# EAGLE design etherbotix (EAGLE 7.1.0)
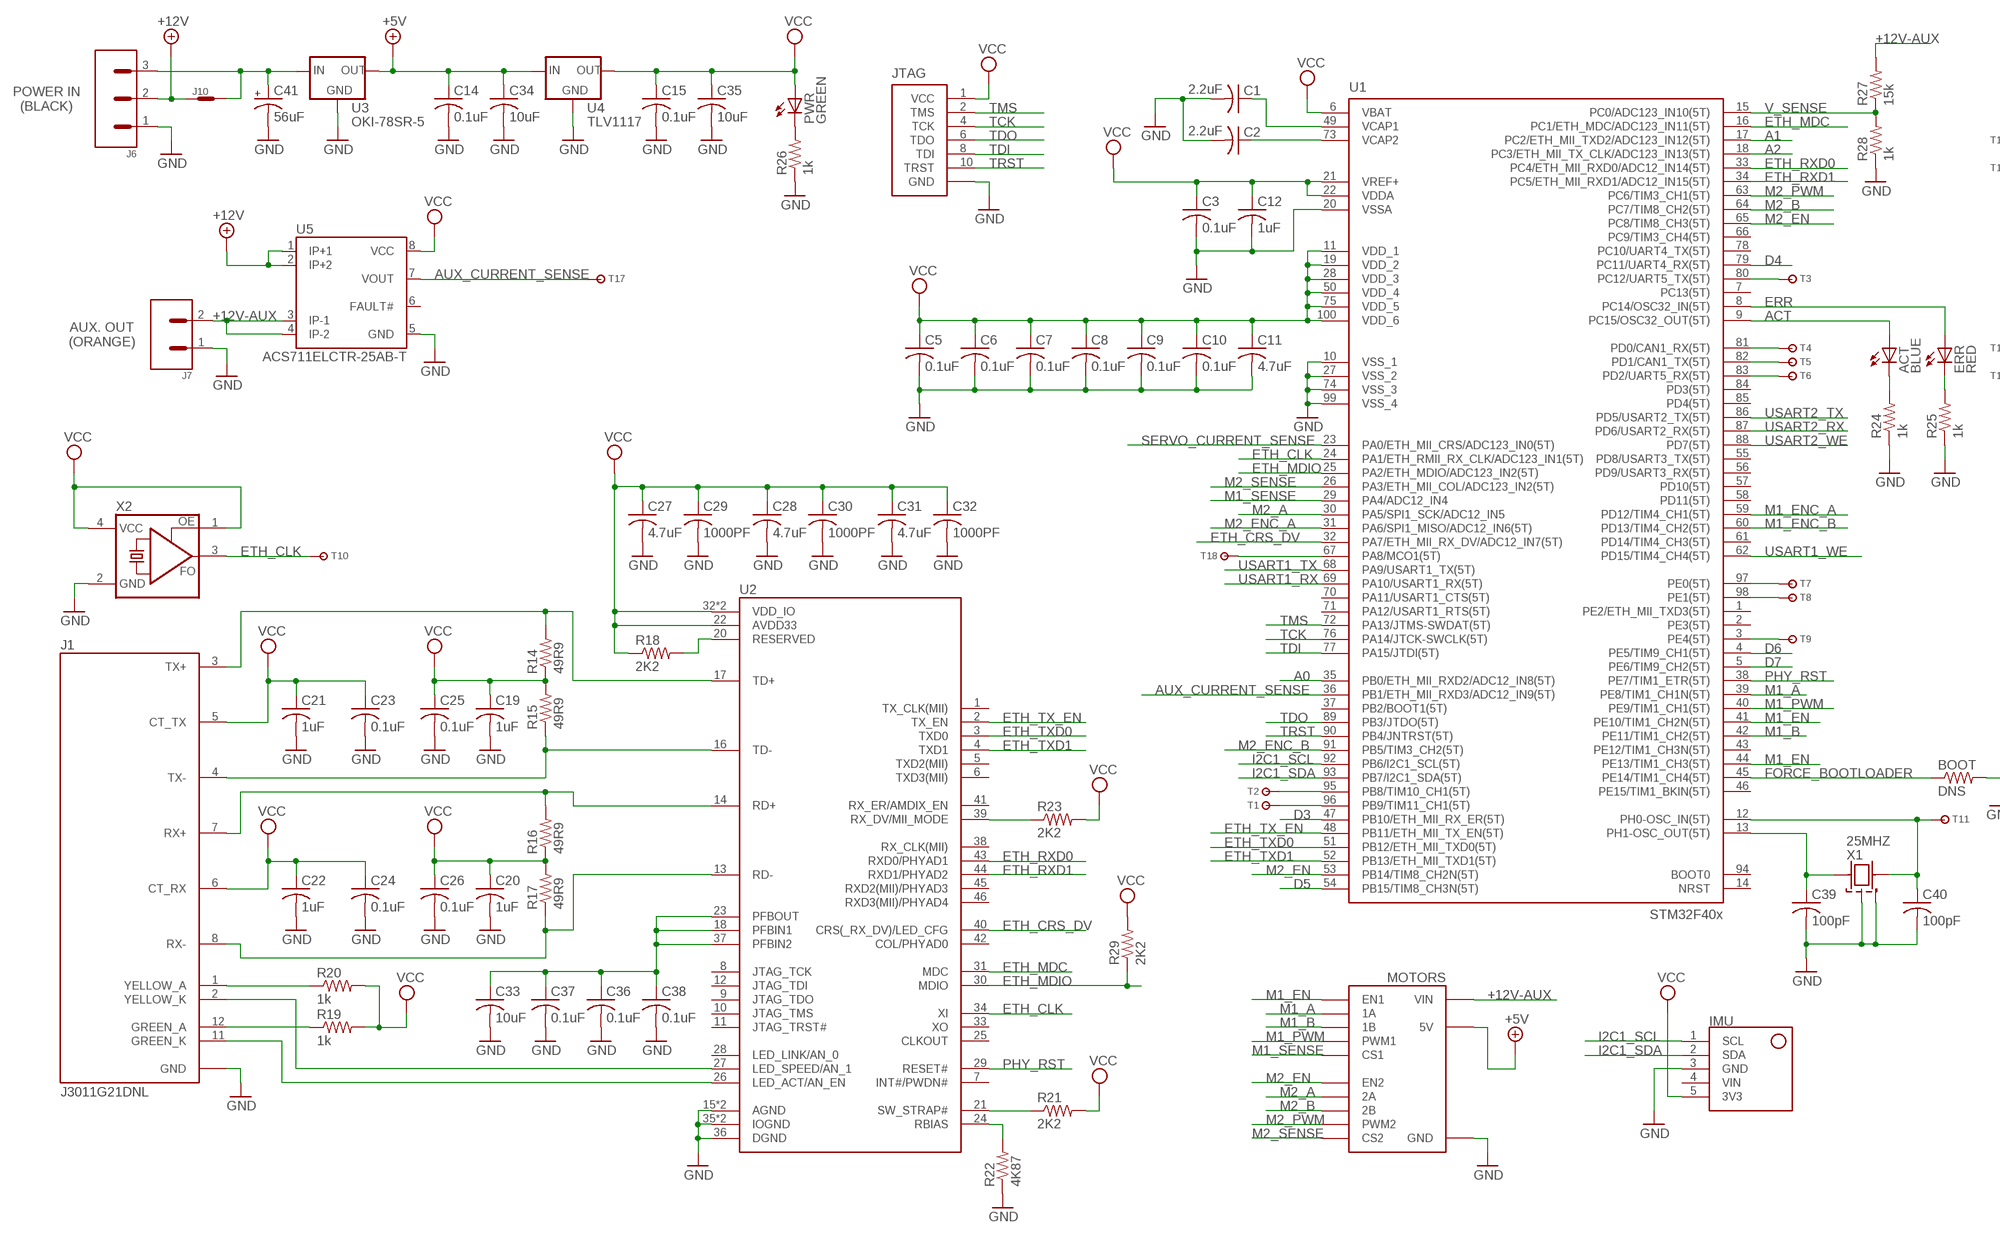
[diagram p0: schematic, sheet 1, part 1 of 2]
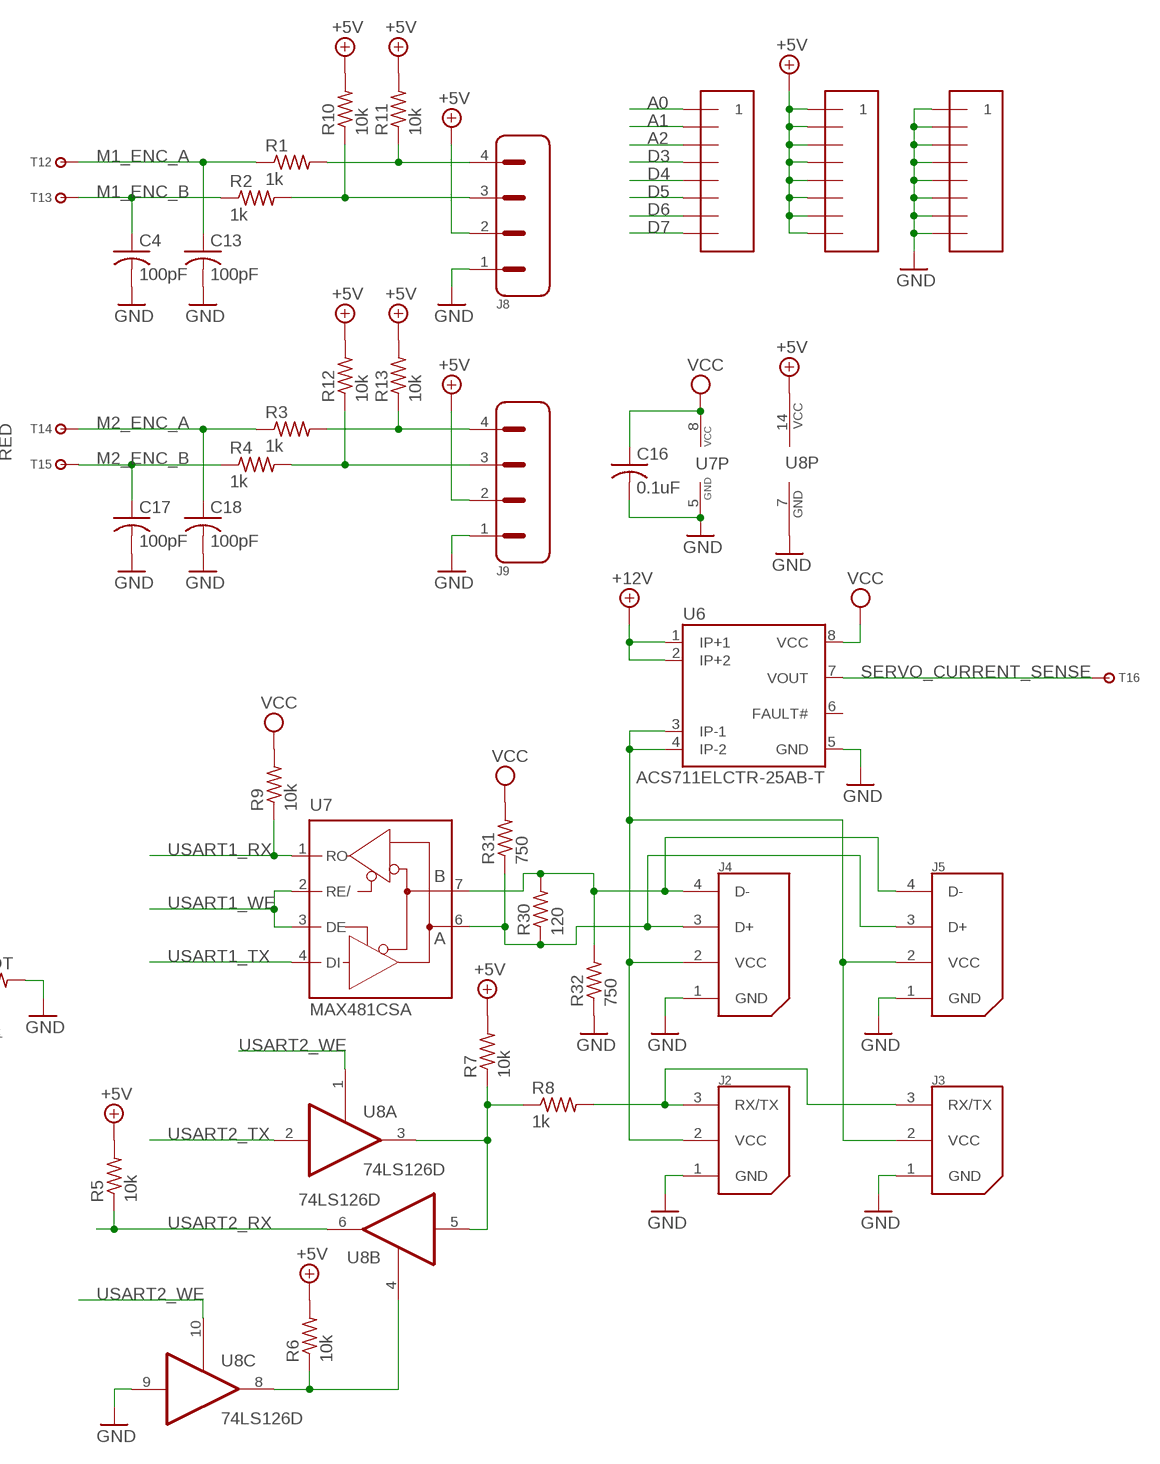
[diagram p1: schematic, sheet 1, part 2 of 2]

## Parts
ACT  BLUE  APT1608SGC  [LED0603]
BOOT  DNS  P1.00KHCT-ND  [0603]
C1  2.2uF  C1608X5R1C225K  [C0603]
C2  2.2uF  C1608X5R1C225K  [C0603]
C3  0.1uF  C1608X7R1H104K  [C0603]
C4  100pF  C1608C0G1H101J  [C0603]
C5  0.1uF  C1608X7R1H104K  [C0603]
C6  0.1uF  C1608X7R1H104K  [C0603]
C7  0.1uF  C1608X7R1H104K  [C0603]
C8  0.1uF  C1608X7R1H104K  [C0603]
C9  0.1uF  C1608X7R1H104K  [C0603]
C10  0.1uF  C1608X7R1H104K  [C0603]
C11  4.7uF  C1608X5R0J475K  [0603]
C12  1uF  C1608X5R1H105M  [C0603]
C13  100pF  C1608C0G1H101J  [C0603]
C14  0.1uF  C1608X7R1H104K  [C0603]
C15  0.1uF  C1608X7R1H104K  [C0603]
C16  0.1uF  C1608X7R1H104K  [C0603]
C17  100pF  C1608C0G1H101J  [C0603]
C18  100pF  C1608C0G1H101J  [C0603]
C19  1uF  C1608X5R1H105M  [C0603]
C20  1uF  C1608X5R1H105M  [C0603]
C21  1uF  C1608X5R1H105M  [C0603]
C22  1uF  C1608X5R1H105M  [C0603]
C23  0.1uF  C1608X7R1H104K  [C0603]
C24  0.1uF  C1608X7R1H104K  [C0603]
C25  0.1uF  C1608X7R1H104K  [C0603]
C26  0.1uF  C1608X7R1H104K  [C0603]
C27  4.7uF  C1608X5R0J475K  [0603]
C28  4.7uF  C1608X5R0J475K  [0603]
C29  1000PF  C1608X7R1H102K  [0603]
C30  1000PF  C1608X7R1H102K  [0603]
C31  4.7uF  C1608X5R0J475K  [0603]
C32  1000PF  C1608X7R1H102K  [0603]
C33  10uF  C1608X5R0J106M  [C0603]
C34  10uF  C1608X5R0J106M  [C0603]
C35  10uF  C1608X5R0J106M  [C0603]
C36  0.1uF  C1608X7R1H104K  [C0603]
C37  0.1uF  C1608X7R1H104K  [C0603]
C38  0.1uF  C1608X7R1H104K  [C0603]
C39  100pF  C1608C0G1H101J  [C0603]
C40  100pF  C1608C0G1H101J  [C0603]
C41  56uF  25SVPF56M  [OSCON_SVPF_6.3MM]
ERR  RED  APT1608SGC  [LED0603]
IMU  MINI9IMU  [MINI9IMU]
J1  J3011G21DNL  [J3]
J2  22-03-5035  [5267-3]
J3  22-03-5035  [5267-3]
J4  22-03-5045  [5267-4]
J5  22-03-5045  [5267-4]
J6  1760520000  [1760520000]
J7  1760490000  [1760490000]
J8  502443-0470  [502443-0470]
J9  502443-0470  [502443-0470]
J10  JUMPER  [J2]
JTAG  CORTEX_DEBUG-SHROUDED  [3220-10-0300-00]
MOTORS  MD03A  [MD03A]
PWR  GREEN  APT1608SGC  [LED0603]
R1  1k  P1.00KHCT-ND  [0603]
R2  1k  P1.00KHCT-ND  [0603]
R3  1k  P1.00KHCT-ND  [0603]
R4  1k  P1.00KHCT-ND  [0603]
R5  10k  P10.0KHCT-ND  [0603]
R6  10k  P10.0KHCT-ND  [0603]
R7  10k  P10.0KHCT-ND  [0603]
R8  1k  P1.00KHCT-ND  [0603]
R9  10k  P10.0KHCT-ND  [0603]
R10  10k  P10.0KHCT-ND  [0603]
R11  10k  P10.0KHCT-ND  [0603]
R12  10k  P10.0KHCT-ND  [0603]
R13  10k  P10.0KHCT-ND  [0603]
R14  49R9  P49.9HCT-ND  [0603]
R15  49R9  P49.9HCT-ND  [0603]
R16  49R9  P49.9HCT-ND  [0603]
R17  49R9  P49.9HCT-ND  [0603]
R18  2K2  P2.20KHCT-ND  [0603]
R19  1k  P1.00KHCT-ND  [0603]
R20  1k  P1.00KHCT-ND  [0603]
R21  2K2  P2.20KHCT-ND  [0603]
R22  4K87  P4.87KHCT-ND  [0603]
R23  2K2  P2.20KHCT-ND  [0603]
R24  1k  P1.00KHCT-ND  [0603]
R25  1k  P1.00KHCT-ND  [0603]
R26  1k  P1.00KHCT-ND  [0603]
R27  15k  P15.0KHCT-ND  [0603]
R28  1k  P1.00KHCT-ND  [0603]
R29  2K2  P2.20KHCT-ND  [0603]
R30  120  P120HCT-ND  [0603]
R31  750  P750HCT-ND  [0603]
R32  750  P750HCT-ND  [0603]
T1  TESTPAD  [TEST]
T2  TESTPAD  [TEST]
T3  TESTPAD  [TEST]
T4  TESTPAD  [TEST]
T5  TESTPAD  [TEST]
T6  TESTPAD  [TEST]
T7  TESTPAD  [TEST]
T8  TESTPAD  [TEST]
T9  TESTPAD  [TEST]
T10  TESTPAD  [TEST]
T11  TESTPAD  [TEST]
T12  TESTPAD  [TEST]
T13  TESTPAD  [TEST]
T14  TESTPAD  [TEST]
T15  TESTPAD  [TEST]
T16  TESTPAD  [TEST]
T17  TESTPAD  [TEST]
T18  TESTPAD  [TEST]
U1  STM32F407V  [TQFP100]
U2  TLK110  [LQFP48]
U3  OKI-78SR-5  OKI-78SR-5/1.5-W36-C  [OKI-78SR]
U4  TLV1117  TLV1117-33IKVURG3KVU  [DPAK]
U5  ACS711ELCTR-25AB-T  [SOIC8]
U6  ACS711ELCTR-25AB-T  [SOIC8]
U7  MAX481CSA  [SO08]
U8  74LS126D  [SO14]
U$1  HEADER8  [1X8]
U$2  HEADER8  [1X8]
U$3  HEADER8  [1X8]
X1  25MHZ  ABM3B-25.000MHZ-B2-T  [4LCC]
X2  ASEMB-50.000MHZ-XY-T  [OSCILLATOR]

## Nets
+5V: C14.1 C34.1 J8.2 J9.2 MOTORS.5V R5.2 R6.2 R7.2 R10.2 R11.2 R12.2 R13.2 U3.P$3(OUT) U4.3(IN) U8.14(P:VCC) U$2.P$1 U$2.P$2 U$2.P$3 U$2.P$4 U$2.P$5 U$2.P$6 U$2.P$7 U$2.P$8
+12V: J6.2 J10.A U5.1(IP+1) U5.2(IP+2) U6.1(IP+1) U6.2(IP+2)
+12V-AUX: J7.2 MOTORS.VIN1(VIN) MOTORS.VIN2(VIN) R27.2 U5.3(IP-1) U5.4(IP-2)
A0: U1.35(PB0/ETH_MII_RXD2/ADC12_IN8(5T)) U$1.P$1
A1: U1.17(PC2/ETH_MII_TXD2/ADC123_IN12(5T)) U$1.P$2
A2: U1.18(PC3/ETH_MII_TX_CLK/ADC123_IN13(5T)) U$1.P$3
ACT: ACT.A U1.9(PC15/OSC32_OUT(5T))
AUX_CURRENT_SENSE: T17.T U1.36(PB1/ETH_MII_RXD3/ADC12_IN9(5T)) U5.7(VOUT)
D3: U1.47(PB10/ETH_MII_RX_ER(5T)) U$1.P$4
D4: U1.79(PC11/UART4_RX(5T)) U$1.P$5
D5: U1.54(PB15/TIM8_CH3N(5T)) U$1.P$6
D6: U1.4(PE5/TIM9_CH1(5T)) U$1.P$7
D7: U1.5(PE6/TIM9_CH2(5T)) U$1.P$8
ERR: ERR.A U1.8(PC14/OSC32_IN(5T))
ETH_CLK: T10.T U1.24(PA1/ETH_RMII_RX_CLK/ADC123_IN1(5T)) U2.34(XI) X2.3(FO)
ETH_CRS_DV: U1.32(PA7/ETH_MII_RX_DV/ADC12_IN7(5T)) U2.40(CRS(_RX_DV)/LED_CFG)
ETH_MDC: U1.16(PC1/ETH_MDC/ADC123_IN11(5T)) U2.31(MDC)
ETH_MDIO: R29.1 U1.25(PA2/ETH_MDIO/ADC123_IN2(5T)) U2.30(MDIO)
ETH_RXD0: U1.33(PC4/ETH_MII_RXD0/ADC12_IN14(5T)) U2.43(RXD0/PHYAD1)
ETH_RXD1: U1.34(PC5/ETH_MII_RXD1/ADC12_IN15(5T)) U2.44(RXD1/PHYAD2)
ETH_TX_EN: U1.48(PB11/ETH_MII_TX_EN(5T)) U2.2(TX_EN)
ETH_TXD0: U1.51(PB12/ETH_MII_TXD0(5T)) U2.3(TXD0)
ETH_TXD1: U1.52(PB13/ETH_MII_TXD1(5T)) U2.4(TXD1)
FORCE_BOOTLOADER: BOOT.1 U1.45(PE14/TIM1_CH4(5T))
GND: BOOT.2 C1.2 C2.2 C3.2 C4.2 C5.2 C6.2 C7.2 C8.2 C9.2 C10.2 C11.2 C12.2 C13.2 C14.2 C15.2 C16.2 C17.2 C18.2 C19.2 C20.2 C21.2 C22.2 C23.2 C24.2 C25.2 C26.2 C27.2 C28.2 C29.2 C30.2 C31.2 C32.2 C33.2 C34.2 C35.2 C36.2 C37.2 C38.2 C39.2 C40.2 C41.- IMU.3(GND) J1.9(GND) J1.10(GND) J1.A(GND) J1.B(GND) J2.1(GND) J3.1(GND) J4.1(GND) J5.1(GND) J6.1 J7.1 J8.1 J9.1 JTAG.3(GND) JTAG.5(GND) JTAG.9(GND) MOTORS.GND1(GND) MOTORS.GND2(GND) R22.1 R24.1 R25.1 R26.1 R28.1 R32.1 U1.10(VSS_1) U1.20(VSSA) U1.27(VSS_2) U1.74(VSS_3) U1.99(VSS_4) U2.15(AGND) U2.19(AGND) U2.35(IOGND) U2.36(DGND) U2.47(IOGND) U3.P$2(GND) U4.1(GND) U5.5(GND) U6.5(GND) U7.5(GND) U8.7(P:GND) U8.9(C:I) U$3.P$1 U$3.P$2 U$3.P$3 U$3.P$4 U$3.P$5 U$3.P$6 U$3.P$7 U$3.P$8 X1.2(G1) X1.4(G2) X2.2(GND)
I2C1_SCL: IMU.1(SCL) U1.92(PB6/I2C1_SCL(5T))
I2C1_SDA: IMU.2(SDA) U1.93(PB7/I2C1_SDA(5T))
M1_A: MOTORS.1A U1.39(PE8/TIM1_CH1N(5T))
M1_B: MOTORS.1B U1.42(PE11/TIM1_CH2(5T))
M1_EN: MOTORS.EN1 U1.41(PE10/TIM1_CH2N(5T)) U1.44(PE13/TIM1_CH3(5T))
M1_ENC_A: C13.1 R1.1 T12.T U1.59(PD12/TIM4_CH1(5T))
M1_ENC_B: C4.1 R2.1 T13.T U1.60(PD13/TIM4_CH2(5T))
M1_PWM: MOTORS.PWM1 U1.40(PE9/TIM1_CH1(5T))
M1_SENSE: MOTORS.CS1 U1.29(PA4/ADC12_IN4)
M2_A: MOTORS.2A U1.30(PA5/SPI1_SCK/ADC12_IN5)
M2_B: MOTORS.2B U1.64(PC7/TIM8_CH2(5T))
M2_EN: MOTORS.EN2 U1.53(PB14/TIM8_CH2N(5T)) U1.65(PC8/TIM8_CH3(5T))
M2_ENC_A: C18.1 R3.1 T14.T U1.31(PA6/SPI1_MISO/ADC12_IN6(5T))
M2_ENC_B: C17.1 R4.1 T15.T U1.91(PB5/TIM3_CH2(5T))
M2_PWM: MOTORS.PWM2 U1.63(PC6/TIM3_CH1(5T))
M2_SENSE: MOTORS.CS2 U1.26(PA3/ETH_MII_COL/ADC123_IN2(5T))
N$1: J1.4(TX-) R15.1 U2.16(TD-)
N$2: J2.2(VCC) J3.2(VCC) J4.2(VCC) J5.2(VCC) U6.3(IP-1) U6.4(IP-2)
N$3: C39.1 U1.13(PH1-OSC_OUT(5T)) X1.1
N$4: C1.1 U1.49(VCAP1)
N$5: C2.1 U1.73(VCAP2)
N$6: J8.3 R2.2 R10.1
N$7: J8.4 R1.2 R11.1
N$8: J9.4 R3.2 R13.1
N$9: J9.3 R4.2 R12.1
N$10: J4.3(D+) J5.3(D+) R30.1 R31.1 U7.6(A)
N$11: J4.4(D-) J5.4(D-) R30.2 R32.2 U7.7(B)
N$12: R7.1 R8.1 U8.3(A:O) U8.5(B:I)
N$13: R6.1 U8.4(B:OE) U8.8(C:O)
N$14: J2.3(RX/TX) J3.3(RX/TX) R8.2
N$15: C40.1 T11.T U1.12(PH0-OSC_IN(5T)) X1.3
N$16: J1.3(TX+) R14.2 U2.17(TD+)
N$17: R18.2 U2.20(RESERVED)
N$18: J1.2(YELLOW_K) U2.27(LED_SPEED/AN_1)
N$19: J1.7(RX+) R16.2 U2.14(RD+)
N$20: J1.11(GREEN_K) U2.26(LED_ACT/AN_EN)
N$21: J1.8(RX-) R17.1 U2.13(RD-)
N$22: J1.1(YELLOW_A) R20.1
N$23: J1.12(GREEN_A) R19.1
N$24: C33.1 C36.1 C37.1 C38.1 U2.18(PFBIN1) U2.23(PFBOUT) U2.37(PFBIN2)
N$25: R21.1 U2.21(SW_STRAP#)
N$26: R22.2 U2.24(RBIAS)
N$27: R23.1 U2.39(RX_DV/MII_MODE)
N$28: PWR.C R26.2
N$29: C41.+ J6.3 J10.B U3.P$1(IN)
N$30: ERR.C R25.2
N$31: ACT.C R24.2
PA8: T18.T U1.67(PA8/MCO1(5T))
PB8: T2.T U1.95(PB8/TIM10_CH1(5T))
PB9: T1.T U1.96(PB9/TIM11_CH1(5T))
PC12: T3.T U1.80(PC12/UART5_TX(5T))
PD0: T4.T U1.81(PD0/CAN1_RX(5T))
PD1: T5.T U1.82(PD1/CAN1_TX(5T))
PD2: T6.T U1.83(PD2/UART5_RX(5T))
PE0: T7.T U1.97(PE0(5T))
PE1: T8.T U1.98(PE1(5T))
PE4: T9.T U1.3(PE4(5T))
PHY_RST: U1.38(PE7/TIM1_ETR(5T)) U2.29(RESET#)
SERVO_CURRENT_SENSE: T16.T U1.23(PA0/ETH_MII_CRS/ADC123_IN0(5T)) U6.7(VOUT)
TCK: JTAG.4(TCK) U1.76(PA14/JTCK-SWCLK(5T))
TDI: JTAG.8(TDI) U1.77(PA15/JTDI(5T))
TDO: JTAG.6(TDO) U1.89(PB3/JTDO(5T))
TMS: JTAG.2(TMS) U1.72(PA13/JTMS-SWDAT(5T))
TRST: JTAG.10(TRST) U1.90(PB4/JNTRST(5T))
USART1_RX: R9.1 U1.69(PA10/USART1_RX(5T)) U7.1(RO)
USART1_TX: U1.68(PA9/USART1_TX(5T)) U7.4(DI)
USART1_WE: U1.62(PD15/TIM4_CH4(5T)) U7.2(RE/) U7.3(DE)
USART2_RX: R5.1 U1.87(PD6/USART2_RX(5T)) U8.6(B:O)
USART2_TX: U1.86(PD5/USART2_TX(5T)) U8.2(A:I)
USART2_WE: U1.88(PD7(5T)) U8.1(A:OE) U8.10(C:OE)
V_SENSE: R27.1 R28.2 U1.15(PC0/ADC123_IN10(5T))
VCC: C3.1 C5.1 C6.1 C7.1 C8.1 C9.1 C10.1 C11.1 C12.1 C15.1 C16.1 C19.1 C20.1 C21.1 C22.1 C23.1 C24.1 C25.1 C26.1 C27.1 C28.1 C29.1 C30.1 C31.1 C32.1 C35.1 IMU.5(3V3) J1.5(CT_TX) J1.6(CT_RX) JTAG.1(VCC) PWR.A R9.2 R14.1 R15.2 R16.1 R17.2 R18.1 R19.2 R20.2 R21.2 R23.2 R29.2 R31.2 U1.6(VBAT) U1.11(VDD_1) U1.19(VDD_2) U1.21(VREF+) U1.22(VDDA) U1.28(VDD_3) U1.50(VDD_4) U1.75(VDD_5) U1.100(VDD_6) U2.22(AVDD33) U2.32(VDD_IO) U2.48(VDD_IO) U4.4(OUT) U5.8(VCC) U6.8(VCC) U7.8(VCC) X2.1(OE) X2.4(VCC)
Unconnected: IMU.4(VIN) U1.1(PE2/ETH_MII_TXD3(5T)) U1.2(PE3(5T)) U1.7(PC13(5T)) U1.14(NRST) U1.37(PB2/BOOT1(5T)) U1.43(PE12/TIM1_CH3N(5T)) U1.46(PE15/TIM1_BKIN(5T)) U1.55(PD8/USART3_TX(5T)) U1.56(PD9/USART3_RX(5T)) U1.57(PD10(5T)) U1.58(PD11(5T)) U1.61(PD14/TIM4_CH3(5T)) U1.66(PC9/TIM3_CH4(5T)) U1.70(PA11/USART1_CTS(5T)) U1.71(PA12/USART1_RTS(5T)) U1.78(PC10/UART4_TX(5T)) U1.84(PD3(5T)) U1.85(PD4(5T)) U1.94(BOOT0) U2.1(TX_CLK(MII)) U2.5(TXD2(MII)) U2.6(TXD3(MII)) U2.7(INT#/PWDN#) U2.8(JTAG_TCK) U2.9(JTAG_TDO) U2.10(JTAG_TMS) U2.11(JTAG_TRST#) U2.12(JTAG_TDI) U2.25(CLKOUT) U2.28(LED_LINK/AN_0) U2.33(XO) U2.38(RX_CLK(MII)) U2.41(RX_ER/AMDIX_EN) U2.42(COL/PHYAD0) U2.45(RXD2(MII)/PHYAD3) U2.46(RXD3(MII)/PHYAD4) U5.6(FAULT#) U6.6(FAULT#) U8.11(D:O) U8.12(D:I) U8.13(D:OE)

## Notes on the sheet
- POWER IN
  (BLACK)
- AUX. OUT
  (ORANGE)

## Library data of the parts
ACT ERR PWR = fergs:APT1608SGC: LED 568NM GREEN CLR 0603 SMD
BOOT = fergs:P1.00KHCT-ND: (C5) RES 1.00K OHM 1/10W 1% 0603 SMD; VALUE: 1k
C1 C2 = fergs:C1608X5R1C225K: (A10) CAP CER 2.2UF 16V 10% X5R 0603
C3 C5-C10 C14-C16 C23-C26 C36-C38 = fergs:C1608X7R1H104K: (A7) CAP CER 0.1UF 50V 10% X7R 0603
C4 C13 C17 C18 C39 C40 = fergs:C1608C0G1H101J: (A3) CAP CER 100PF 50V 5% NP0 0603
C11 C27 C28 C31 = fergs:C1608X5R0J475K: (A13) CAP CER 4.7UF 6.3V 10% X5R
C12 C19-C22 = fergs:C1608X5R1H105M: (A9) 1uF 50V 20% X5R 0603
C29 C30 C32 = fergs:C1608X7R1H102K: (A4) CAP CER 1000PF 50V 10% X7R 0603
C33-C35 = fergs:C1608X5R0J106M: (A14) CAP CER 10UF 6.3V 20% X5R 0603
C41 = fergs:25SVPF56M: CAP POLYMER 56UF 25V 20% SMD; RIPPLE: 2.8A
IMU = pololu:MINI9IMU: Pololu Mini-IMU v2
J1 = ethernet:J3011G21DNL: CONN MAGJACK 1PORT 100 BASE-TX tested: YES (etherbotix)
J2 J3 = molex:22-03-5035: Molex SPOX Vert, Tin (Dynamixel AX/MX Bus) tested: YES (arbotix)
J4 J5 = molex:22-03-5045: Molex SPOX Vert, Tin (Dynamixel RX Bus) tested: YES (arbotix2)
J6 = headers:1760520000: 15A 3P TERM BLOCK, BLACK tested: NO
J7 = headers:1760490000: 15A 2P TERM BLOCK, ORANGE tested: NO
J8 J9 = molex:502443-0470: CONN RCPT VERT 4POS 2.00MM PCB tested: YES (etherbotix)
J10 = headers:JUMPER
JTAG = headers:CORTEX_DEBUG: CONN HEADER 10POS DL UNSHRD SMD tested: YES (etherbotix)
MOTORS = pololu:MD03A: Pololu MD03A Motor Driver
R1-R4 R8 R19 R20 R24-R26 R28 = fergs:P1.00KHCT-ND: (C5) RES 1.00K OHM 1/10W 1% 0603 SMD
R5-R7 R9-R13 = fergs:P10.0KHCT-ND: (C10) RES 10.0K OHM 1/10W 1% 0603 SMD
R14-R17 = fergs:P49.9HCT-ND: (C3) RES 49.9 OHM 1/10W 1% 0603 SMD
R18 R21 R23 R29 = fergs:P2.20KHCT-ND: (C7) RES 2.2K OHM 1/10W 1% 0603 SMD
R22 = fergs:P4.87KHCT-ND: RES 4.87K OHM 1/10W 1% 0603 SMD
R27 = fergs:P15.0KHCT-ND: (C11) RES 15.0K OHM 1/10W 1% 0603 SMD
R30 = fergs:P120HCT-ND: RES 120 OHM 1/10W 1% 0603 SMD
R31 R32 = fergs:P750HCT-ND: RES 750 OHM 1/10W 1% 0603 SMD
T1-T18 = fergs:TESTPAD
U1 = stm32f4:STM32F407V: STM32F407 100 pin LQFP tested: YES (etherbotix)
U2 = ethernet:TLK110: IC ETHERNET PHY 10/100 48LQFP tested: NO
U3 = power:OKI-78SR*-W36-C: CONV DC/DC 36VIN tested: YES (etherbotix); VOLTAGE: 5
U4 = power:TLV1117-33IKVURG3: IC REG LDO 3.3V 0.8A TO252-3 tested: YES (etherbotix)
U5 U6 = allegro:ACS711E: SENSOR CURRENT 3.3V 8-SOIC tested: YES (etherbotix); CURRENT: 25A
U7 = maxim:MAX481CSA: RS485 TRANSEIVER; MF: MAXIM; MPN: MAX481CSA; OC_FARNELL: unknown; OC_NEWARK: 90C3817
U8 = 74xx-us:74*126: Quad bus BUFFER, 3-state
U$1-U$3 = headers:HEADER8
X1 = stm32f4:ABM3B-*MHZ-B2-T: CRYSTAL, SMD tested: YES (etherbotix); FREQ: 25.000; LOAD_CAPACITANCE: 18pF
X2 = ethernet:ASEMB-50.000MHZ-XY-T: OSC MEMS 50.000MHZ CMOS SMD

## Board
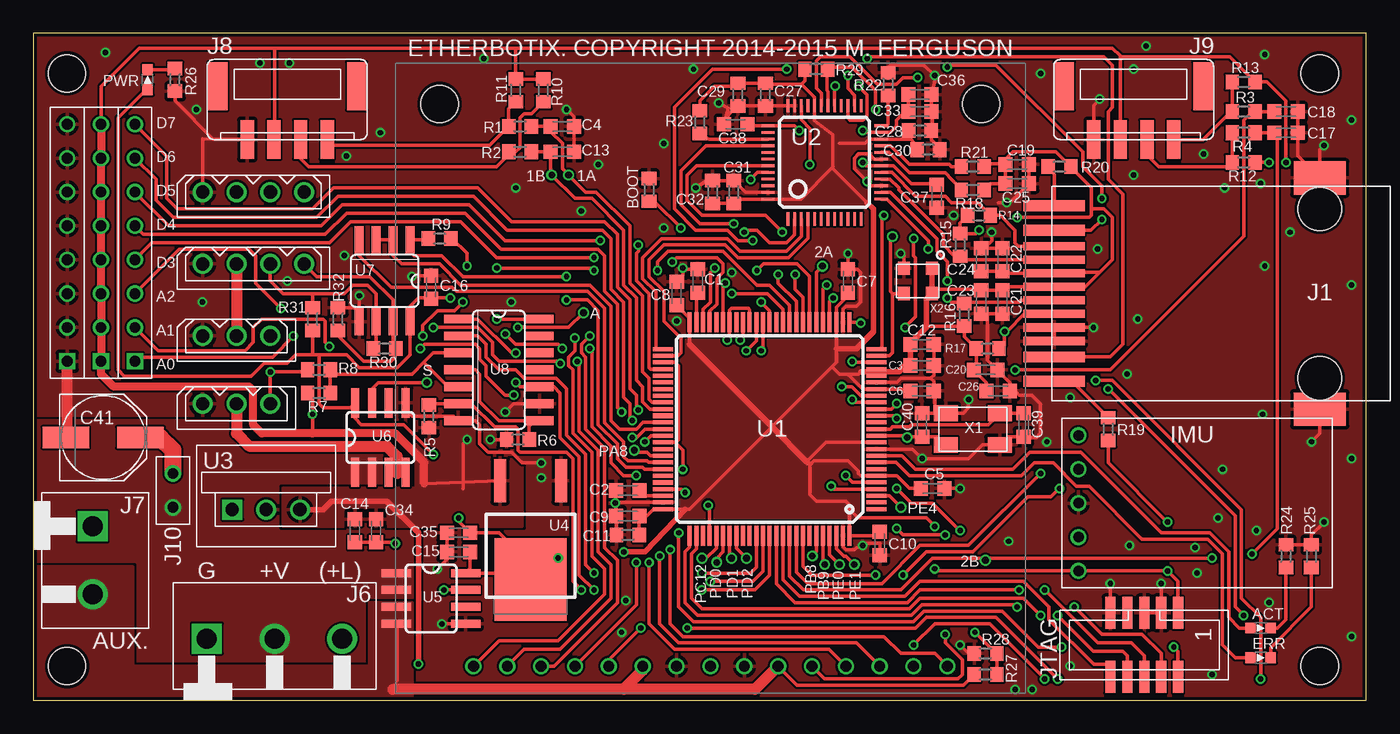
[diagram p2: board, top side]
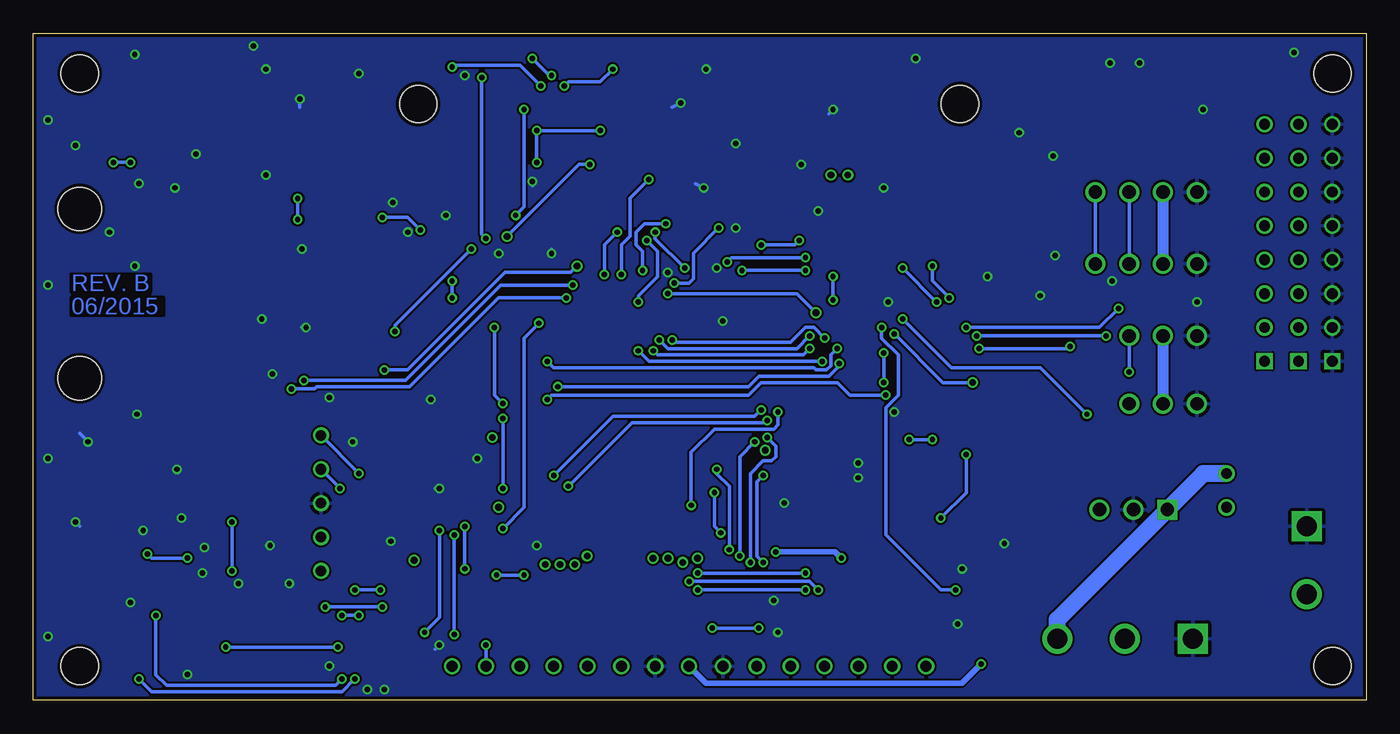
[diagram p3: board, bottom side, seen from below]

Size 100 x 50 mm. Coordinates in mm from the lower left corner, seen from the top.
Outline: 0,0 100,0 100,50 0,50 0,0
Copper layers (1*16): Top 0.035mm / dielectric 0.2mm / Bottom 0.035mm
Design rules "SeeedStudio_DRU_no_angle_20130527 *": minimum track width 7mil, minimum drill 12mil, track to track 6mil, track to pad 6mil, pad to pad 6mil, via to via 6mil, smd to smd 0mil, copper to edge 10mil, drill to drill 10mil, minimum pad ring 6mil, minimum via ring 6mil, stop-mask expansion 2mil, vias tented up to drill 25mil, thermal gap 10mil
Holes 2.79 mm at 2.54,46.99 2.54,2.54 96.52,2.54 96.52,46.99

### Footprints (pad centres in the part's own frame; a part is rotated, then mirrored left to right if it is on the bottom)
LED0603 = smd 0.8 x 0.8: A 0,-0.75; C 0,0.75
0603 = smd 1 x 1.1: 1 -0.85,0; 2 0.85,0
C0603 = smd 1.05 x 1.08: 1 -0.875,0; 2 0.875,0
OSCON_SVPF_6.3MM = smd 3.5 x 1.6: + 2.8,0; - -2.8,0
MINI9IMU = drill 0.8: 1 0,5.08; 2 0,2.54; 3 0,0; 4 0,-2.54; 5 0,-5.08
J3 = smd 4.597 x 0.813: 1 -19.926,6.579; 2 -19.926,4.75; 11 -19.926,-4.75; 12 -19.926,-6.579 | smd 4.597 x 0.61: 3 -19.926,3.556; 4 -19.926,2.54; 5 -19.926,1.524; 6 -19.926,0.508; 7 -19.926,-0.508; 8 -19.926,-1.524; 9 -19.926,-2.54; 10 -19.926,-3.556 | smd 3.912 x 2.489: A 0,8.674; B 0,-8.674 | hole 3.251: 0,-6.35; 0,6.35
5267-3 = drill 1: 1 0,0; 2 -2.54,0; 3 -5.08,0
5267-4 = drill 1: 1 0,0; 2 -2.54,0; 3 -5.08,0; 4 -7.62,0
1760520000 = drill 1.5 square: 1 0,0 | drill 1.5: 2 5.08,0; 3 10.16,0
1760490000 = drill 1.5 square: 1 0,0 | drill 1.5: 2 5.08,0
502443-0470 = smd 1 x 2.9: 1 3,4; 2 1,4; 3 -1,4; 4 -3,4 | smd 1.45 x 3.6: P$5 -5.2,0; P$6 5.2,0
J2 = drill 0.813: A 0,0; B 2.54,0
3220-10-0300-00 = smd 2.4 x 0.76: 1 -2.4,2.54; 2 2.4,2.54; 3 -2.4,1.27; 4 2.4,1.27; 5 -2.4,0; 6 2.4,0; 7 -2.4,-1.27; 8 2.4,-1.27; 9 -2.4,-2.54; 10 2.4,-2.54
MD03A = drill 0.813: 1A 0,15.24; 1B 0,12.7; 2A 0,-15.24; 2B 0,-12.7; 5V 0,0; CS1 0,7.62; CS2 0,-7.62; EN1 0,17.78; EN2 0,-17.78; GND1 0,2.54; GND2 0,-2.54; PWM1 0,10.16; PWM2 0,-10.16; VIN1 0,5.08; VIN2 0,-5.08 | hole 2.8: 42.164,20.32; 42.164,-20.32
TEST = drill 0.508: T 0,0
TQFP100 = smd 1.5 x 0.3: 1 -8,6; 2 -8,5.5; 3 -8,5; 4 -8,4.5; 5 -8,4; 6 -8,3.5; 7 -8,3; 8 -8,2.5; 9 -8,2; 10 -8,1.5; 11 -8,1; 12 -8,0.5; 13 -8,0; 14 -8,-0.5; 15 -8,-1; 16 -8,-1.5; 17 -8,-2; 18 -8,-2.5; 19 -8,-3; 20 -8,-3.5; 21 -8,-4; 22 -8,-4.5; 23 -8,-5; 24 -8,-5.5; 25 -8,-6; 51 8,-6; 52 8,-5.5; 53 8,-5; 54 8,-4.5; 55 8,-4; 56 8,-3.5; 57 8,-3; 58 8,-2.5; 59 8,-2; 60 8,-1.5; 62 8,-0.5; 63 8,0; 64 8,0.5; 65 8,1; 66 8,1.5; 67 8,2; 68 8,2.5; 69 8,3; 70 8,3.5; 72 8,4.5; 73 8,5; 74 8,5.5; 75 8,6 | smd 0.3 x 1.5: 26 -6,-8; 27 -5.5,-8; 28 -5,-8; 29 -4.5,-8; 30 -4,-8; 31 -3.5,-8; 32 -3,-8; 33 -2.5,-8; 34 -2,-8; 35 -1.5,-8; 36 -1,-8; 37 -0.5,-8; 38 0,-8; 39 0.5,-8; 40 1,-8; 41 1.5,-8; 42 2,-8; 43 2.5,-8; 44 3,-8; 45 3.5,-8; 46 4,-8; 47 4.5,-8; 48 5,-8; 49 5.5,-8; 50 6,-8; 76 6,8; 77 5.5,8; 78 5,8; 79 4.5,8; 80 4,8; 81 3.5,8; 82 3,8; 83 2.5,8; 84 2,8; 85 1.5,8; 86 1,8; 87 0.5,8; 88 0,8; 89 -0.5,8; 90 -1,8; 91 -1.5,8; 92 -2,8; 93 -2.5,8; 94 -3,8; 95 -3.5,8; 96 -4,8; 97 -4.5,8; 98 -5,8; 99 -5.5,8; 100 -6,8 | smd 1.5 x 0.35: 61 8,-1; 71 8,4
LQFP48 = smd 0.2 x 1: 1 -2.75,-4.25; 2 -2.25,-4.25; 3 -1.75,-4.25; 4 -1.25,-4.25; 5 -0.75,-4.25; 6 -0.25,-4.25; 7 0.25,-4.25; 8 0.75,-4.25; 9 1.25,-4.25; 10 1.75,-4.25; 11 2.25,-4.25; 12 2.75,-4.25; 25 2.75,4.25; 26 2.25,4.25; 27 1.75,4.25; 28 1.25,4.25; 29 0.75,4.25; 30 0.25,4.25; 31 -0.25,4.25; 32 -0.75,4.25; 33 -1.25,4.25; 34 -1.75,4.25; 35 -2.25,4.25; 36 -2.75,4.25 | smd 1 x 0.2: 13 4.25,-2.75; 14 4.25,-2.25; 15 4.25,-1.75; 16 4.25,-1.25; 17 4.25,-0.75; 18 4.25,-0.25; 19 4.25,0.25; 20 4.25,0.75; 21 4.25,1.25; 22 4.25,1.75; 23 4.25,2.25; 24 4.25,2.75; 37 -4.25,2.75; 38 -4.25,2.25; 39 -4.25,1.75; 40 -4.25,1.25; 41 -4.25,0.75; 42 -4.25,0.25; 43 -4.25,-0.25; 44 -4.25,-0.75; 45 -4.25,-1.25; 46 -4.25,-1.75; 47 -4.25,-2.25; 48 -4.25,-2.75
OKI-78SR = drill 1 square: P$1 -2.54,0 | drill 1: P$2 0,0; P$3 2.54,0
DPAK = smd 3.2 x 0.93: 1 7.4,-2.29; 3 7.4,2.29 | smd 6.2 x 5.4: 4 0,0
SOIC8 = smd 0.6 x 2.2: 1 -1.905,-2.6; 2 -0.635,-2.6; 3 0.635,-2.6; 4 1.905,-2.6; 5 1.905,2.6; 6 0.635,2.6; 7 -0.635,2.6; 8 -1.905,2.6
SO08 = smd 0.66 x 2.032: 1 -1.905,-3.073; 2 -0.635,-3.073; 3 0.635,-3.073; 4 1.905,-3.073; 5 1.905,3.073; 6 0.635,3.073; 7 -0.635,3.073; 8 -1.905,3.073
SO14 = smd 0.66 x 2.032: 1 -3.81,-3.073; 2 -2.54,-3.073; 3 -1.27,-3.073; 4 0,-3.073; 5 1.27,-3.073; 6 2.54,-3.073; 7 3.81,-3.073; 8 3.81,3.073; 9 2.54,3.073; 10 1.27,3.073; 11 0,3.073; 12 -1.27,3.073; 13 -2.54,3.073; 14 -3.81,3.073
1X8 = drill 0.813 square: P$1 0,0 | drill 0.813: P$2 2.54,0; P$3 5.08,0; P$4 7.62,0; P$5 10.16,0; P$6 12.7,0; P$7 15.24,0; P$8 17.78,0
4LCC = smd 1.803 x 1.194: 1 -2.032,-1.194; 2 2.032,-1.194; 3 2.032,1.194; 4 -2.032,1.194
OSCILLATOR = smd 0.9 x 1: 1 -1.05,-0.95; 2 1.05,-0.95; 3 1.05,0.95; 4 -1.05,0.95

### Placement (x,y rotation side)
ACT  92.08,5.4 270 top
BOOT  46.2,38.26 90 top
C1  49.85,31.43 90 top
C2  44.61,15.72 180 top
C3  66.67,25.08 0 top
C4  39.69,41.12 0 top
C5  67.47,15.88 0 top
C6  66.67,23.18 0 top
C7  61.12,31.43 90 top
C8  48.26,30.48 90 top
C9  44.61,13.81 180 top
C10  63.5,11.75 270 top
C11  44.61,12.38 180 top
C12  66.67,26.67 0 top
C13  39.69,43.02 0 top
C14  24.13,12.7 270 top
C15  31.91,11.11 180 top
C16  29.84,30.96 90 top
C17  93.98,42.55 0 top
C18  93.98,44.13 0 top
C19  73.82,40.16 0 top
C20  71.44,24.77 0 top
C21  72.71,29.84 270 top
C22  72.71,33.02 90 top
C23  71.12,29.84 270 top
C24  71.12,33.02 90 top
C25  73.82,38.73 0 top
C26  72.39,23.18 0 top
C27  54.93,45.4 270 top
C28  66.52,42.7 0 top
C29  52.86,45.4 270 top
C30  67.15,41.27 0 top
C31  52.55,38.1 90 top
C32  50.96,38.1 90 top
C33  66.52,44.13 0 top
C34  25.72,12.7 270 top
C35  31.91,12.54 180 top
C36  66.52,45.4 0 top
C37  67.79,37.78 270 top
C38  52.7,43.18 180 top
C39  74.3,20.64 270 top
C40  66.67,20.64 90 top
C41  5.24,19.68 0 top
ERR  92.08,3.17 270 top
IMU  78.42,14.76 0 top
J1  96.52,30.48 0 top
J2  12.7,27.3 180 top
J3  12.7,22.23 180 top
J4  12.7,32.7 180 top
J5  12.7,38.1 180 top
J6  13.02,4.6 0 top
J7  4.45,13.02 270 top
J8  19.05,46.04 180 top
J9  82.55,46.04 180 top
J10  10.48,14.45 90 top
JTAG  83.34,4.13 270 top
MOTORS  50.8,2.54 90 top
PWR  8.57,46.51 0 top
R1  36.51,43.02 180 top
R2  36.51,41.12 180 top
R3  90.81,44.13 180 top
R4  90.81,42.55 180 top
R5  29.69,21.27 270 top
R6  36.35,19.53 180 top
R7  21.43,23.02 180 top
R8  21.43,24.77 180 top
R9  30.48,34.61 0 top
R10  38.26,45.72 90 top
R11  36.2,45.72 90 top
R12  90.81,40.32 0 top
R13  90.81,46.35 0 top
R14  70.96,36.35 0 top
R15  69.53,34.13 90 top
R16  69.85,28.89 90 top
R17  71.6,26.35 180 top
R18  70.48,38.26 180 top
R19  80.64,20.32 270 top
R20  76.99,40.01 0 top
R21  70.48,40.01 0 top
R22  64.14,46.2 270 top
R23  50.01,43.34 90 top
R24  93.98,10.79 270 top
R25  95.89,10.79 270 top
R26  10.64,46.51 90 top
R27  71.44,1.91 180 top
R28  71.44,3.49 0 top
R29  58.74,47.31 180 top
R30  26.35,26.35 0 top
R31  20.95,28.57 270 top
R32  22.86,28.57 270 top
T1  59.37,10.16 0 top
T2  58.45,10.79 0 top
T3  50.16,10.64 0 top
T4  51.28,10.32 0 top
T5  52.39,10.64 0 top
T6  53.5,10.64 0 top
T7  60.48,10.16 0 top
T8  61.59,10.16 0 top
T9  65.09,14.45 0 top
T10  64.45,34.77 0 top
T11  65.56,19.68 0 top
T12  40.16,39.37 0 top
T13  38.89,39.37 0 top
T14  59.21,32.54 0 top
T15  71.44,10.48 0 top
T16  29.53,23.81 0 top
T17  41.27,29.05 0 top
T18  45.09,18.73 0 top
U1  55.24,20.32 180 top
U2  59.37,40.32 0 top
U3  17.46,14.29 0 top
U4  37.31,9.05 90 top
U5  29.84,7.62 270 top
U6  26.04,19.68 0 top
U7  26.35,31.43 180 top
U8  34.92,24.77 270 top
U$1  7.62,25.4 90 top
U$2  5.08,25.4 90 top
U$3  2.54,25.4 90 top
X1  70.48,20.32 180 top
X2  66.36,31.43 180 top

### Tracks (layer width: path | path; a pad name or v marks a point on that pad's centre or on a via)
+5V  (via drill 0.41)
  Top 0.254: 81.55,48.21 81.6,48.26 89.75,48.26 R13.2 92.55,46.35 93.98,44.93 v93.98,40.32 | v92.71,40.32 R12.2 | U$2.P$8 5.08,46.04 7.94,48.9 18.1,48.9 | 18.1,48.9 18.1,42.09 J8.2 | J9.2 81.55,48.21 | 81.55,48.21 81.55,48.31 80.96,48.9 36.2,48.9 | 36.2,48.9 18.1,48.9 | 36.2,48.9 R11.2 R10.2 | U8.14 v34.77,28.57 | 20.95,20 v20.95,21.43 20.95,22.64 R7.2 | R6.2 v34.29,19.53 | v32.54,19.53 32.23,19.21 32.23,15.84 | 29.33,16.23 U4.3
  Top 0.406: v28.89,2.7 28.89,12.54 26.51,14.92 22.38,14.92 21.75,14.29 U3.P$3
  Top 0.61: U$2.P$8 U$2.P$7 U$2.P$6 U$2.P$5 U$2.P$4 U$2.P$3 U$2.P$2 U$2.P$1 5.08,24.45 6.03,23.5 16.19,23.5 16.51,23.18 16.51,20.64 17.14,20 20.95,20 27.15,20 29.33,17.82 29.33,16.23
  Bottom 0.254: v93.98,40.32 v92.71,40.32 | v34.77,28.57 31.11,24.92 24.45,24.92 v20.95,21.43 | v34.29,19.53 v32.54,19.53
  Bottom 0.406: MOTORS.5V 49.53,1.27 30.32,1.27 v28.89,2.7
  pour Top: 36.67,13.02 18.73,13.02 18.73,15.88 28.73,15.88 28.73,21.27 36.67,21.27
+12V
  pour Top (rank 2, no thermals): 0,20.95 28.42,20.95 28.42,0 0,0
+12V-AUX
  Top 0.254: 27.3,1.43 27.3,5.66 U5.4 | R27.2 69.79,1.11 57.31,1.11 MOTORS.VIN2
  Top 0.813: MOTORS.VIN1 45.72,2.22 44.29,0.79 | 44.29,0.79 26.99,0.79 | MOTORS.VIN2 54.13,0.79 44.29,0.79
  pour Top (no thermals): 0,10 7.46,10 7.46,2.54 25.24,2.54 25.24,7.3 28.42,7.3 28.42,0 0,0
A0  (via drill 0.41)
  Top 0.254: U1.35 56.74,29.61 55.24,31.11 54.29,31.11 51.75,33.66 47.62,33.66 46.83,32.86 v46.83,32.23 | U$1.P$1 7.94,25.72 17.94,25.72 v19.53,27.3 | v29.21,27.3 29.21,28.1 30.32,29.21 31.59,29.21 v32.23,29.84 | v34.77,32.38 41.91,32.38 v42.07,32.23
  Bottom 0.254: v19.53,27.3 v29.21,27.3 | v32.23,29.84 v34.77,32.38 | v42.07,32.23 v46.83,32.23
A1  (via drill 0.41)
  Top 0.254: U$1.P$2 9.37,26.19 15.88,26.19 16.51,26.83 16.51,27.94 17.14,28.57 21.75,28.57 21.91,28.42 21.91,26.83 v22.23,26.51 | v29.05,26.35 29.37,26.67 33.18,26.67 33.5,26.35 33.5,25.56 33.97,25.08 33.97,24.29 35.4,22.86 v36.04,22.86 | U1.17 61.66,22.32 v61.44,22.54
  Bottom 0.254: v22.23,26.51 22.38,26.35 v29.05,26.35 | v36.04,22.86 38.73,22.86 39.69,23.81 45.4,23.81 46.35,22.86 61.12,22.86 v61.44,22.54
A2  (via drill 0.41)
  Top 0.254: v30,27.94 33.34,27.94 34.45,26.83 34.45,25.88 34.92,25.4 39.37,25.4 v39.53,25.24 | U1.18 62.11,22.82 61.44,23.5 v60.64,23.5 | v18.57,29.37 16.67,31.27 16.67,33.34 16.19,33.81 10.95,33.81 U$1.P$3
  Bottom 0.254: v18.57,29.37 20,27.94 v30,27.94 | v60.64,23.5 46.35,23.5 45.56,24.29 40.32,24.29 39.53,25.08 v39.53,25.24
ACT
  Top 0.254: U1.9 65.18,18.32 66.2,17.3 73.5,17.3 74.77,18.57 78.58,18.57 84.61,12.54 88.27,12.54 89.69,11.11 89.69,6.19 90.49,5.4 ACT.A
AUX_CURRENT_SENSE  (via drill 0.41)
  Top 0.254: U1.36 56.24,29.32 55.09,30.48 v52.39,30.48 | v36.35,27.94 40.16,27.94 T17.T | v30.8,8.26 U5.7
  Bottom 0.254: v52.39,30.48 42.7,30.48 T17.T | v36.35,27.94 36.35,27.15 35.08,25.88 35.08,22.86 36.04,21.91 36.04,12.38 31.91,8.26 v30.8,8.26
D3  (via drill 0.41)
  Top 0.254: U$1.P$4 8.89,34.29 22.23,34.29 23.81,35.88 32.07,35.88 34.77,33.18 v42.07,33.18 | U1.47 50.74,29.16 51.28,29.69 51.28,31.59 51.75,32.07 51.75,32.7 51.28,33.18 48.26,33.18 v47.94,32.86
  Bottom 0.254: v47.94,32.86 47.62,33.18 v42.07,33.18
D4  (via drill 0.41)
  Top 0.254: U$1.P$5 8.26,34.92 21.91,34.92 23.5,36.51 32.38,36.51 35.08,33.81 42.39,33.81 42.86,33.34 42.86,30.64 43.81,29.69 43.81,21.91 v44.13,21.59 | U1.79 50.74,14.5 v50.64,14.61
  Bottom 0.254: v44.13,21.59 44.13,20.64 44.45,20.32 48.9,20.32 50.64,18.57 v50.64,14.61
D5  (via drill 0.41)
  Top 0.254: U$1.P$6 10.16,35.56 21.59,35.56 23.18,37.15 32.7,37.15 35.4,34.45 v42.55,34.45 | U1.54 46.3,24.82 46.2,24.92 46.2,30.48 45.24,31.43 45.24,33.5 45.4,33.66 v45.4,34.13
  Bottom 0.254: v42.55,34.45 42.86,34.13 v45.4,34.13
D6  (via drill 0.41)
  Top 0.254: U$1.P$7 9.21,39.05 9.21,37.47 10.48,36.2 21.27,36.2 22.86,37.78 33.02,37.78 35.56,35.24 42.7,35.24 43.34,34.61 43.34,30.8 44.29,29.84 44.29,22.7 44.77,22.23 44.77,21.11 v44.93,20.95 | U1.4 60.06,15.82 v59.85,16.03
  Bottom 0.254: v59.85,16.03 55.09,20.8 45.09,20.8 v44.93,20.95
D7  (via drill 0.41)
  Top 0.254: U$1.P$8 10,40.8 10,37.62 10.79,36.83 20.95,36.83 22.54,38.42 33.34,38.42 35.88,35.88 42.86,35.88 43.81,34.92 43.81,30.96 44.77,30 44.77,23.34 45.24,22.86 45.24,21.91 v45.4,21.75 | U1.5 61.47,16.32 v60.96,16.83
  Bottom 0.254: v60.96,16.83 56.52,21.27 45.88,21.27 v45.4,21.75
ERR
  Top 0.254: U1.8 64.73,17.82 65.72,16.83 74.14,16.83 75.09,17.78 76.52,17.78 78.26,16.03 79.22,16.03 83.19,12.06 88.11,12.06 89.22,10.95 89.22,4.13 90.17,3.17 ERR.A
ETH_CLK  (via drill 0.41)
  Top 0.254: U1.24 64.24,25.82 64.45,26.04 64.45,30.42 X2.3 64.45,30.48 64.29,30.64 64.29,34.61 T10.T | U2.34 57.62,43.5 58.26,42.86 v58.26,40.16
  Bottom 0.254: v58.26,40.16 59.05,40.16 T10.T
ETH_CRS_DV  (via drill 0.41)
  Top 0.254: U1.32 58.24,31.77 57.31,32.7 54.77,32.7 v54.29,32.23 | v52.55,35.72 50.01,35.72 48.58,37.15 48.58,39.69 50.46,41.57 U2.40
  Bottom 0.254: v54.29,32.23 54.29,33.66 54.77,34.13 54.77,35.08 54.13,35.72 v52.55,35.72
ETH_MDC  (via drill 0.41)
  Top 0.254: U1.16 64.36,21.82 v64.77,22.23 | v65.41,27.94 66.2,28.73 66.2,33.18 66.04,33.34 v66.04,34.61 | v66.36,46.67 65.25,46.67 64.77,46.2 63.34,46.2 61.28,48.26 59.05,48.26 58.74,47.94 58.74,45.88 59.12,45.49 U2.31
  Bottom 0.254: v64.77,22.23 65.41,22.86 v65.41,27.94 | v66.36,46.67 66.36,34.92 v66.04,34.61
ETH_MDIO  (via drill 0.41)
  Top 0.254: U1.25 63.47,26.32 63.66,26.51 63.66,36.2 v63.82,36.35 | 59.94,47.59 R29.1 | v63.18,44.29 63.18,45.72 61.44,47.47 60.01,47.47 59.53,47.31 59.5,47.27 59.46,47.27 | 59.85,47.31 59.46,47.27 | 59.46,47.27 R29.1 | U2.30 59.62,45.63 59.53,45.72 59.53,47.09 R29.1
  Bottom 0.254: v63.18,44.29 63.18,36.99 v63.82,36.35
ETH_RXD0  (via drill 0.41)
  Top 0.254: U1.33 57.74,30.2 57.15,30.8 v57.15,31.91 | v56.2,35.08 54.93,36.35 50.16,36.35 49.05,37.47 49.05,39.37 49.76,40.07 U2.43
  Bottom 0.254: v57.15,31.91 57.15,34.13 v56.2,35.08
ETH_RXD1  (via drill 0.41)
  Top 0.254: U1.34 57.24,29.91 55.88,31.27 v55.88,31.91 | U2.44 54.34,39.57 v53.82,39.05
  Bottom 0.254: v55.88,31.91 55.88,34.13 55.24,34.77 55.24,37.62 v53.82,39.05
ETH_TX_EN  (via drill 0.41)
  Top 0.254: U1.48 50.24,29.29 50.8,29.84 50.8,32.07 v51.12,32.38 | U2.2 57.12,34.9 56.52,34.29 55.24,34.29 54.29,35.24 53.5,35.24 v53.34,35.08
  Bottom 0.254: v53.34,35.08 53.34,34.61 v51.12,32.38
ETH_TXD0
  Top 0.254: U1.51 46.7,26.32 46.7,30.61 45.72,31.59 45.72,33.18 47.15,34.61 52.07,34.61 53.02,33.66 56.52,33.66 57.62,34.76 U2.3
ETH_TXD1
  Top 0.254: U1.52 48.36,25.82 48.58,26.04 48.58,27.15 47.31,28.42 47.31,30.64 46.2,31.75 46.2,33.02 47.31,34.13 51.91,34.13 52.86,33.18 56.67,33.18 58.12,34.63 U2.4
FORCE_BOOTLOADER  (via drill 0.41)
  Top 0.254: U1.45 51.74,31.11 v51.91,31.27 | v48.58,35.4 46.67,37.31 46.3,37.31 BOOT.1
  Bottom 0.254: v51.91,31.27 50.8,31.27 50.48,31.59 50.48,33.5 v48.58,35.4
GND  (via drill 0.41)
  Top 0.254: J5.1 12.72,42.09 J8.1 16.02,42.07 13.49,42.07 10.64,44.93 R26.1 | JTAG.9 v80.8,8.73 | JTAG.5 JTAG.3 v84.61,8.73 | U1.20 64.78,23.82 65.09,24.13 67.31,24.13 | 67.31,24.13 67.55,23.89 C6.2 67.63,23.1 67.63,21.51 | 67.31,24.13 67.55,24.37 C3.2 C12.2 | U1.99 60.74,11.49 60.96,11.27 61.59,11.27 61.75,11.43 v62.23,11.59 62.39,11.59 62.55,11.75 63.5,11.75 C10.2 | v96.84,13.34 95.89,12.38 R25.1 R24.1 | C5.2 v69.53,15.88 | v70.17,22.54 70.17,21.91 69.77,21.51 X1.2 | U2.47 53.42,38.07 C31.2 C32.2 50.54,38.95 v49.69,38.42 | U2.35 U2.36 55.27,44.57 C27.2 C29.2 52.81,44.55 52.15,43.89 C38.2 52.15,44.37 v51.44,44.77 | C18.2 C17.2 94.86,40.82 J1.A 96.52,41.27 v96.84,41.59 | J9.1 79.55,44.62 v80.01,45.09 | U7.5 24.45,29.05 | 24.45,29.05 24.07,29.43 R32.1 | U8.9 36.04,22.23 v35.4,21.59 | v38.1,17.78 36.67,17.78 35.88,18.57 34.13,18.57 33.5,19.21 33.5,20.64 33.18,20.95 U8.7 31.53,21.27 28.42,21.27 27.94,21.75 U6.5 | R28.1 70.17,3.49 v69.53,4.13 | C14.2 C34.2 27.07,11.82 v27.15,11.75 | J1.10 J1.9 v79.53,27.94 | J1.B 96.52,20 v95.89,19.37 | U1.27 60.74,29.31 60.96,29.53 61.75,29.53 62.07,29.84 62.07,32.07 61.83,32.31 C7.2 v61.12,33.5 | 24.45,29.05 v24.45,30.32 | R22.1 64.14,47.47 64.29,47.62 66.83,47.62 v67.63,46.83 67.71,46.75 C36.2 C33.2 67.53,44.11 C28.2 67.37,42.01 68.1,41.27 C30.2 | v40.01,44.29 40.56,43.73 C13.2 C4.2 | 71.52,28.97 C23.2 | C22.2 71.36,33.9 | C24.2 71.36,33.9 | 71.36,33.9 71.91,34.45 v71.91,35.08 | C21.2 71.52,28.97 | 71.52,28.97 71.6,28.89 71.6,25.48 C20.2 73.27,23.81 C26.2 73.66,23.18 73.98,22.86 74.93,22.86 75.56,22.23 75.56,20 75.25,19.68 74.37,19.68 C39.2 73.15,19.76 X1.4 71.2,19.13 70.17,18.1 v66.67,18.1 65.95,18.82 U1.10
  Top 0.254: C19.2 C25.2 73.27,37.31 v73.03,37.31 72.39,37.31 | U2.15 62.86,38.57 v62.55,38.89 61.59,39.85 61.59,40.64 61.91,40.96 62.71,40.96 63.09,40.57 U2.19 | U5.5 v30.64,5.71 | C35.2 C15.2 31.03,10.55 v30.32,9.84 | C8.2 48.74,31.83 v48.74,32.38 48.81,32.31 C1.2 | U1.74 43.71,14.82 v43.66,14.76 | C2.2 43.73,14.84 v43.66,14.76 | v43.66,14.76 43.73,14.69 C9.2 43.76,13.79 C11.2 | C40.2 67.63,21.51 | 67.63,21.51 X1.2 | X1.2 | C16.2 28.5,31.83 v28.42,31.75 | X2.2 65.31,33.28 v65.09,33.5
  Top 0.813: C41.- 2.86,19.68 2.54,20 U$3.P$1
  Bottom 0.254: v84.61,8.73 84.61,8.89 | v96.84,13.34 96.52,13.02 | v69.53,15.88 69.85,15.88 | v49.69,38.42 50.32,38.73 | v80.01,45.09 80.01,44.45 | v51.44,44.77 52.07,44.45 | v69.53,4.13 69.85,3.81 | v79.53,27.94 79.85,27.94 | v95.89,19.37 96.52,20 | v61.12,33.5 61.12,33.81 | v40.01,44.29 40.32,43.97 | v71.91,35.08 71.75,34.92 | v62.55,38.89 62.55,38.58 | v73.03,37.31 72.87,37.31 | v30.64,5.71 30.8,5.71 | v30.32,9.84 30.48,10
  other vias: 38.1,16.67 82.87,28.57 82.55,39.37 89.38,38.42 82.07,24.45 92.08,38.73 92.39,32.54 89.22,17.3 91.76,12.7 92.23,21.43 98.9,18.1 98.9,4.76 87.31,9.53 98.9,31.11 94.3,35.08 98.9,43.5 83.5,49.05 49.53,47.31 47.31,35.4 42.39,40.16 26.04,42.55 19.21,47.78 33.81,48.1 5.4,48.58 12.22,44.29 16.99,47.78 36.2,38.42 41.12,36.67 12.7,29.84 75.56,46.99 47.31,41.75 77.79,2.54 74.93,0.79 73.66,0.79 88.42,1.91 92.71,7.3 73.18,11.91 82.23,11.59 87.15,11.43 44.13,5.08 44.45,7.46 35.88,29.84 48.26,28.42 52.39,32.07 23.5,40.8 23.34,33.34 79.85,33.81 87.79,40.96 82.55,47.31 92.39,48.42 88.9,13.65 77.79,22.7 76.04,19.37 19.05,31.43 69.06,36.35
  pour Bottom: 0,49.85 100.01,49.85 100.01,0 0,0
  pour Top: 37.15,18.73 40.32,18.73 40.32,13.02 37.15,13.02
  pour Top (rank 3): 0,50.01 100.01,50.01 100.01,0 0,0
I2C1_SCL  (via drill 0.41)
  Top 0.254: U1.92 57.24,9.59 58.1,8.73 63.66,8.73 66.52,11.59 70.17,11.59 v75.56,16.99
  Bottom 0.254: v75.56,16.99 IMU.1
I2C1_SDA  (via drill 0.41)
  Top 0.254: U1.93 57.74,10.04 58.42,9.37 v63.18,9.37 | v65.25,9.37 66.99,11.11 70.48,11.11 74.61,15.24 76.36,15.24 v76.99,15.88
  Bottom 0.254: v63.18,9.37 v65.25,9.37 | v76.99,15.88 IMU.2
M1_A  (via drill 0.41)
  Top 0.254: MOTORS.1A 36.83,3.81 39.53,3.81 43.34,7.62 43.34,10.16 42.39,11.11 42.39,18.73 40.96,20.16 40.96,25.24 v40.8,25.4 | U1.39 54.74,26.33 v54.61,26.19
  Bottom 0.254: v54.61,26.19 53.82,25.4 v40.8,25.4
M1_B  (via drill 0.41)
  Top 0.254: MOTORS.1B 39.05,2.54 43.81,7.3 43.81,10.48 42.86,11.43 42.86,18.89 41.43,20.32 41.43,25.72 41.12,26.04 41.12,26.67 v41.75,27.3 | U1.42 53.24,27.21 v53.02,26.99
  Bottom 0.254: v53.02,26.99 52.39,26.35 42.7,26.35 v41.75,27.3
M1_EN  (via drill 0.41)
  Top 0.254: MOTORS.EN1 34.92,4.45 39.37,4.45 42.86,7.94 42.86,9.84 41.91,10.79 41.91,18.57 40.48,20 40.48,24.77 40.16,25.08 40.16,25.72 40.64,26.19 v40.64,27.15 | U1.41 53.74,29.28 53.66,29.37 52.39,29.37 52.24,29.23 U1.44 52.24,27.16 v52.07,26.99
  Bottom 0.254: v52.07,26.99 51.91,26.83 43.18,26.83 42.07,27.94 41.43,27.94 v40.64,27.15
M1_ENC_A
  Top 0.254: R1.1 C13.1 38.81,42.63 39.69,41.75 39.69,39.85 T12.T 41.43,38.1 42.23,38.1 44.77,35.56 44.77,31.27 45.72,30.32 45.72,24.61 46.2,24.13 46.2,22.54 46.42,22.32 U1.59
M1_ENC_B
  Top 0.254: R2.1 C4.1 38.81,39.45 T13.T 40.64,37.62 41.91,37.62 44.29,35.24 44.29,31.11 45.24,30.16 45.24,23.97 45.72,23.5 45.72,22.38 46.28,21.82 U1.60
M1_PWM  (via drill 0.41)
  Top 0.254: MOTORS.PWM1 45.24,7.14 v45.24,10.32 | U1.40 54.24,26.94 v53.5,26.19 | v41.75,26.35 41.91,26.19 41.91,20.48 43.34,19.05 43.34,17.78 44.29,16.83 v45.24,16.83
  Bottom 0.254: v53.5,26.19 53.18,25.88 42.23,25.88 v41.75,26.35 | v45.24,16.83 45.72,16.35 45.72,10.79 v45.24,10.32
M1_SENSE  (via drill 0.41)
  Top 0.254: MOTORS.CS1 43.18,3.02 v45.56,5.4 | U1.29 59.74,29.9 v60.01,30.16 | v80.64,23.34 90.17,13.81 90.17,6.99 v90.81,6.35 | v76.83,1.59 72.23,6.19 66.99,6.19 66.2,5.4 v49.05,5.4
  Bottom 0.254: v60.01,30.16 65.09,30.16 71.75,23.5 78.74,23.5 78.9,23.34 v80.64,23.34 | v90.81,6.35 90.81,1.91 90.01,1.11 77.31,1.11 v76.83,1.59 | v49.05,5.4 v45.56,5.4
M2_A  (via drill 0.41)
  Top 0.254: U1.30 59.24,30.83 v59.53,31.11 | v79.69,23.97 80.96,23.97 90.65,14.29 90.65,7.62 92.08,6.19 v92.08,1.59 | v75.88,1.59 71.75,5.71 67.63,5.71 v66.04,4.13
  Bottom 0.254: v59.53,31.11 64.93,31.11 72.07,23.97 v79.69,23.97 | v92.08,1.59 91.12,0.64 76.83,0.64 v75.88,1.59 | v66.04,4.13 MOTORS.2A
M2_B  (via drill 0.41)
  Top 0.254: MOTORS.2B 61.75,4.29 48.42,4.29 46.99,5.71 v46.99,10.79 | U1.64 46.33,19.82 v45.88,19.37
  Bottom 0.254: v46.99,10.79 46.99,18.26 v45.88,19.37
M2_EN  (via drill 0.41)
  Top 0.254: MOTORS.EN2 67.63,3.49 65.09,3.49 63.82,4.76 48.74,4.76 47.78,5.71 v47.78,11.27 | U1.53 48.18,25.32 48.42,25.08 48.42,19.53 48.21,19.32 48.15,19.32 | U1.65 48.15,19.32 | 48.15,19.32 48.74,18.73 v48.74,17.3
  Bottom 0.254: v48.74,17.3 48.74,16.99 47.78,16.03 v47.78,11.27
M2_ENC_A  (via drill 0.41)
  Top 0.254: C18.1 R3.1 91.44,44.13 90.81,43.5 90.81,34.77 80.8,24.77 v73.66,24.77 | U1.31 58.74,32.08 T14.T
  Bottom 0.254: v73.66,24.77 71.91,24.77 64.61,32.07 59.69,32.07 T14.T
M2_ENC_B  (via drill 0.41)
  Top 0.254: R4.1 C17.1 93.34,42.3 93.34,12.86 v91.44,10.95 | U1.91 56.74,9.29 57.78,8.26 65.09,8.26 67.47,10.64 71.44,10.64 | 71.44,10.64 v88.42,10.64 | T15.T 71.44,10.64
  Bottom 0.254: v88.42,10.64 91.12,10.64 v91.44,10.95
M2_PWM  (via drill 0.41)
  Top 0.254: MOTORS.PWM2 59.69,3.81 48.1,3.81 46.2,5.71 v46.2,10.32 | U1.63 45.88,20.32 45.24,19.68 v44.93,19.68
  Bottom 0.254: v44.93,19.68 44.29,19.05 44.29,18.26 44.61,17.94 45.24,17.94 46.2,16.99 v46.2,10.32
M2_SENSE  (via drill 0.41)
  Top 0.254: U1.26 62.01,28.32 v62.07,28.26 | v64.77,12.86 65.25,12.38 v68.42,12.38 | v68.42,4.92 68.42,4.29 69.69,3.02 69.69,1.91 69.37,1.59 59.37,1.59 MOTORS.CS2
  Bottom 0.254: v62.07,28.26 63.18,27.15 63.18,14.45 v64.77,12.86 | v68.42,12.38 v68.42,4.92
N$1
  Top 0.254: J1.4 69.85,33.02 69.53,33.34 69.64,33.34 R15.1 69.06,33.34 68.26,34.13 68.26,34.92 64.93,38.26 64.93,38.42 64.27,39.07 U2.16
N$2
  Top 0.406: 27.3,16.99 27.88,16.99 U6.4 U6.3
  Top 0.813: J4.2 J2.2 | J3.2 15.24,20 16.19,19.05 26.51,19.05 27.3,18.26 27.3,16.99
  Bottom 0.813: J5.2 J4.2 | J2.2 J3.2
N$3
  Top 0.254: C39.1 72.2,21.51 X1.1 71.64,20.64 65.88,20.64 65.72,20.48 64.45,20.48 64.29,20.32 U1.13
N$4
  Top 0.254: U1.49 49.74,30.66 C1.1
N$5
  Top 0.254: U1.73 45.09,15.32 C2.1
N$6
  Top 0.254: J8.3 20.05,40.59 20.64,40.01 34.77,40.01 35.56,40.8 35.5,40.96 R2.2 36.2,41.12 36.51,41.43 36.51,43.66 36.83,43.97 37.36,43.97 R10.1
N$7
  Top 0.254: J8.4 22.5,41.59 34.23,41.59 R1.2 35.66,44.34 R11.1
N$8
  Top 0.254: R13.1 R3.2 89.85,44.13 87.76,42.04 J9.4
N$9
  Top 0.254: R4.2 R12.1 89.64,40.01 84.45,40.01 83.55,40.91 J9.3
N$10
  Top 0.254: J4.3 17.78,31.43 18.73,30.48 20.95,30.48 | 20.95,30.48 23.34,30.48 23.97,31.11 25.08,31.11 25.72,30.48 U7.6 25.72,26.57 R30.1 | R31.1 20.95,30.48
  Bottom 0.254: J5.3 J4.3
N$11
  Top 0.254: J4.4 21.27,31.75 25.24,31.75 26.99,30 U7.7 26.99,26.57 R30.2 27.15,26.3 27.15,25.72 26.83,25.4 24.77,25.4 22.86,27.3 R32.2
  Bottom 0.254: J5.4 J4.4
N$12
  Top 0.254: U8.3 30,26.04 29.29,25.32 | 29.29,25.32 28.42,24.45 22.6,24.45 R8.1 R7.1 | U8.5 31.11,23.5 29.29,25.32
N$13
  Top 0.254: U8.8 37.62,20.95 | 37.62,20.95 34.92,20.95 33.5,22.38 33.5,24.45 33.18,24.77 U8.4 | R6.1 37.2,20.54 37.62,20.95
N$14  (via drill 0.41)
  Top 0.254: J3.3 v17.78,24.61 20.32,24.61 R8.2
  Bottom 0.254: J2.3 v17.78,24.61
N$15
  Top 0.254: X1.3 67.82,19.76 C40.1 65.64,19.76 T11.T 65.43,19.82 U1.12
N$16
  Top 0.254: J1.3 73.91,34.04 73.66,34.29 73.66,35.24 72.55,36.35 R14.2 70.86,37.31 68.9,37.31 68.42,37.78 66.2,37.78 64.41,39.57 U2.17
N$17
  Top 0.254: U2.20 64.18,41.07 65.72,39.53 68.42,39.53 68.9,39.05 R18.2
N$18  (via drill 0.41)
  Top 0.254: 74.62,35.23 J1.2 79.36,35.23 v80.17,36.04 | v68.58,47.47 68.58,47.62 72.23,47.62 78.74,41.12 78.74,40.01 80.17,38.58 v80.17,37.62 | U2.27 61.12,43.65 61.28,43.5 62.23,43.5 62.55,43.81 62.55,45.4 v61.91,46.04
  Bottom 0.254: v80.17,36.04 v80.17,37.62 | v61.91,46.04 63.5,47.62 68.58,47.62 v68.58,47.47
N$19  (via drill 0.41)
  Top 0.254: J1.7 74.11,29.97 73.98,29.84 69.95,29.84 | 69.95,29.84 R16.2 | 69.95,29.84 68.9,29.84 v68.58,30.16 | v68.58,31.43 68.58,32.86 67.79,33.66 67.79,34.61 64.32,38.07 U2.14
  Bottom 0.254: v68.58,30.16 v68.58,31.43
N$20  (via drill 0.41)
  Top 0.254: J1.11 80.82,25.73 81.76,26.67 81.76,37.94 80.64,39.05 80.64,44.13 80.96,44.45 80.96,47.62 80.33,48.26 62.71,48.26 v62.55,48.1 | U2.26 61.62,45.38 61.12,45.88 v61.12,46.83
  Bottom 0.254: v62.55,48.1 61.28,46.83 v61.12,46.83
N$21  (via drill 0.41)
  Top 0.254: J1.8 74.36,28.96 73.03,27.62 72.87,27.57 | U2.13 64.03,37.57 67.15,34.45 v67.15,33.81 | v72.87,27.62 72.87,27.57 | 72.87,27.57 72.87,26.61 R17.1
  Bottom 0.254: v67.15,33.81 72.87,28.1 v72.87,27.62
N$22
  Top 0.254: J1.1 76.59,39.4 R20.1
N$23
  Top 0.254: J1.12 77.91,23.9 R19.1
N$24  (via drill 0.41)
  Top 0.254: C38.1 54.01,43.07 U2.37 57.1,43.07 v57.47,42.7 | C37.1 67.79,38.73 65.88,38.73 64.54,40.07 U2.18 62.48,40.07 v62.23,40.32 | v62.23,42.7 62.36,42.57 U2.23 64.32,42.57 64.77,43.02 64.77,43.5 65.41,44.13 C33.1 C36.1
  Bottom 0.254: v57.47,42.7 v62.23,42.7 v62.23,40.32
N$25
  Top 0.254: U2.21 64.31,41.57 65.72,40.16 68.74,40.16 68.9,40.01 R21.1
N$26
  Top 0.254: U2.24 64.03,43.07 64.14,43.18 R22.2
N$27
  Top 0.254: U2.39 50.7,42.07 R23.1
N$28
  Top 0.254: PWR.C 10.54,47.26 R26.2
N$29
  Top 1.27: J10.B 10.48,18.73 9.53,19.68 C41.+
  Bottom 1.27: J6.3 23.18,6.03 U3.P$1 12.22,16.99 J10.B
N$30
  Top 0.254: ERR.C 92.83,3.92 95.89,6.99 R25.2
N$31
  Top 0.254: ACT.C 93.34,5.4 93.98,6.03 R24.2
PA8
  Top 0.254: U1.67 46.29,18.32 46.04,18.57 45.24,18.57 T18.T
PB8
  Top 0.254: T2.T 58.74,11.11 U1.95
PB9
  Top 0.254: U1.96 59.24,10.29 T1.T
PC12
  Top 0.254: U1.80 51.24,11.4 50.48,10.64 T3.T
PD0
  Top 0.254: U1.81 51.74,11.11 51.28,10.64 T4.T
PD1
  Top 0.254: U1.82 52.24,10.78 T5.T
PD2
  Top 0.254: U1.83 52.74,11.39 T6.T
PE0
  Top 0.254: U1.97 59.74,10.9 T7.T
PE1
  Top 0.254: U1.98 60.24,11.35 60.8,10.79 60.96,10.79 T8.T
PE4
  Top 0.254: U1.3 64.21,15.32 T9.T
PHY_RST  (via drill 0.41)
  Top 0.254: U1.38 55.24,29.21 v54.61,29.84 | v53.98,34.45 52.86,34.45 52.07,35.24 49.69,35.24 48.1,36.83 48.1,44.45 50.96,47.31 v56.52,47.31 | U2.29 60.12,45.92 v60.17,46.04
  Bottom 0.254: v54.61,29.84 54.61,30.32 53.18,31.75 53.18,33.66 v53.98,34.45 | v60.17,46.04 59.85,46.35 57.47,46.35 v56.52,47.31
SERVO_CURRENT_SENSE  (via drill 0.41)
  Top 0.254: U6.7 25.4,23.34 25.88,23.81 T16.T | v35.4,27.46 36.2,26.67 39.37,26.67 v39.69,26.35 | U1.23 61.52,25.32 v61.44,25.4
  Bottom 0.254: T16.T 31.75,23.81 v35.4,27.46 | v39.69,26.35 40.16,25.88 40.16,25.08 40.48,24.77 41.27,24.77 41.43,24.92 60.96,24.92 v61.44,25.4
TCK  (via drill 0.41)
  Top 0.254: U1.76 49.24,11.46 48.9,11.11 48.9,7.3 49.85,6.35 65.88,6.35 66.67,7.14 73.66,7.14 v73.82,6.99 | JTAG.4 84.61,3.49 83.19,4.92 80.17,4.92 v78.11,6.99
  Bottom 0.254: v78.11,6.99 v73.82,6.99
TDI  (via drill 0.41)
  Top 0.254: v75.56,6.35 74.3,7.62 66.52,7.62 65.72,6.83 50.16,6.83 49.37,7.62 49.37,10.95 49.74,11.33 U1.77 | v76.83,6.35 79.53,3.65 81.76,3.65 82.07,3.33 JTAG.8
  Bottom 0.254: v75.56,6.35 v76.83,6.35
TDO  (via drill 0.41)
  Top 0.254: JTAG.6 83.34,3.33 82.39,4.29 79.85,4.29 v75.88,8.26 | U1.89 55.74,8.71 57.15,7.3 65.56,7.3 66.52,8.26 v73.98,8.26
  Bottom 0.254: v73.98,8.26 v75.88,8.26
TMS  (via drill 0.41)
  Top 0.254: JTAG.2 85.88,3.65 v85.57,3.97 | v77.15,3.97 75.41,3.97 72.71,6.67 66.83,6.67 66.04,5.87 49.53,5.87 48.42,6.99 v48.42,12.54 | U1.72 48.63,15.82 v48.9,15.56
  Bottom 0.254: v85.57,3.97 v77.15,3.97 | v48.42,12.54 48.9,13.02 v48.9,15.56
TRST
  Top 0.254: U1.90 56.24,9 57.47,7.78 65.41,7.78 66.52,8.89 74.3,8.89 76.2,6.99 76.2,6.03 79.55,2.68 80.82,2.68 80.8,2.7 JTAG.10
USART1_RX  (via drill 0.41)
  Top 0.254: R9.1 29.53,34.51 U7.1 28.26,33.66 28.57,33.34 30.64,33.34 32.23,31.75 v40.01,31.75 | v40.01,30 41.59,30 42.39,29.21 42.39,20.64 43.81,19.21 43.81,18.1 44.45,17.46 45.72,17.46 45.86,17.32 U1.69
  Bottom 0.254: v40.01,31.75 v40.01,30
USART1_TX
  Top 0.254: U7.4 24.45,33.34 26.83,30.96 31.43,30.96 31.75,30.64 41.59,30.64 42.86,29.37 42.86,20.8 44.29,19.37 44.29,18.26 44.61,17.94 46.04,17.94 46.16,17.82 U1.68
USART1_WE
  Top 0.254: U7.3 U7.2 26.99,33.34 27.62,32.7 30.48,32.7 32.07,31.11 41.75,31.11 43.34,29.53 43.34,20.95 43.97,20.32 45.24,20.32 45.74,20.82 U1.62
USART2_RX  (via drill 0.41)
  Top 0.254: R5.1 30.11,22.23 U8.6 32.86,22.23 34.61,20.48 36.2,20.48 36.35,20.32 36.35,18.73 36.51,18.57 40.01,18.57 40.48,18.1 40.48,8.89 v41.12,8.26 | U1.87 54.74,9.66 53.98,8.89 v50.8,8.89
  Bottom 0.254: v41.12,8.26 41.75,8.89 v50.8,8.89
USART2_TX  (via drill 0.41)
  Top 0.254: U8.2 33.34,27.3 33.97,26.67 33.97,25.72 34.92,24.77 36.2,24.77 36.83,24.13 39.21,24.13 40.01,23.34 40.01,19.84 41.43,18.41 41.43,10.16 v42.07,9.53 | v50.16,9.53 53.82,9.53 54.24,9.95 U1.86
  Bottom 0.254: v42.07,9.53 v50.16,9.53
USART2_WE  (via drill 0.41)
  Top 0.254: U8.1 33.34,28.57 35.88,26.04 v36.2,26.04 | v36.2,23.81 36.51,23.5 U8.10 39.05,23.5 39.53,23.02 39.53,19.68 40.96,18.26 40.96,9.37 v42.07,8.26 | U1.88 55.24,9.37 54.13,8.26 v50.16,8.26
  Bottom 0.254: v36.2,26.04 v36.2,23.81 | v50.16,8.26 v42.07,8.26
V_SENSE  (via drill 0.41)
  Top 0.254: U1.15 64.56,21.32 v64.77,21.11 | v64.77,15.88 65.88,14.76 67.47,14.76 v69.53,12.7 | R27.1 R28.2 72.23,3.49 v70.64,5.08
  Bottom 0.254: v64.77,21.11 v64.77,15.88 | v69.53,12.7 69.53,6.19 v70.64,5.08
VCC  (via drill 0.41)
  Top 0.254: 30,30.16 28.89,30.16 28.26,29.53 U7.8 28.26,25.88 27.3,24.92 24.45,24.92 23.5,25.88 21.43,25.88 | 30,30.16 30.09,30.16 | 30.09,30.16 C16.1 29.93,29.84 29.77,29.93 30,30.16 | C8.1 49.24,28.62 U1.50 49.24,26.7 49.21,26.67 | C7.1 60.96,30.16 60.24,29.45 U1.28 60.24,26.35 60.24,25.32 59.93,25 | 61.24,14.29 U1.100 63.2,12.32 C10.1 | 61.24,14.29 61.24,14.64 60.96,14.92 58.74,14.92 58.26,15.4 58.26,17.62 | JTAG.1 85.88,8.89 v85.09,9.68 IMU.5 67.79,9.68 v67.63,9.84 | C6.1 65.66,23.32 U1.19 62.25,23.32 61.12,24.45 | C3.1 65.41,25.08 | U1.11 59.48,19.32 58.02,17.86 | v67.63,13.02 66.99,13.65 61.88,13.65 61.24,14.29 | C32.1 C31.1 53.19,37.57 U2.48 57.58,37.57 59.93,39.93 | 55.35,46.35 C27.1 | C27.1 C29.1 52.97,46.04 51.12,46.04 50.01,44.93 R23.2 | C24.1 C22.1 73.17,32 J1.5 76.66,32.07 80.01,32.07 | R19.2 80.64,17.78 v85.09,13.34 | 59.93,39.93 60.01,40.01 60.01,42.39 58.62,43.45 U2.32 58.62,45.2 57.63,46.2 | U6.8 24.13,21.11 24.61,20.64 27.78,20.64 v30,18.41 | 21.43,25.88 21.43,22.23 21.75,21.91 23.75,21.91 U6.8 | 20.95,25.88 R31.2 | C28.1 65.83,42.07 | 65.83,42.07 66.46,41.33 66.36,41.27 C30.1 | 79.38,36.83 79.38,38.42 78.74,39.05 R20.2 76.73,41.12 73.5,41.12 72.94,40.56 C19.1 | 79.38,36.83 80.33,36.83 80.96,36.2 80.96,33.02 80.01,32.07 | 80.01,32.07 78.93,30.99 J1.6 73.08,30.99 C21.1 C23.1 71.12,30.8 67.72,30.8 X2.4 | C26.1 71.52,23.81 C20.1 70.75,24.79 R17.2 69.85,27.25 R16.1 67.09,28.04 66.99,27.94 | R14.1 69.53,35.77 R15.2 70.7,34.98 v70.96,35.24 | R21.2 71.78,40.22 72.65,40.22 72.71,40.16 C19.1 | C19.1 C25.1 71.81,38.73 R18.1 | R9.2 31.43,34.61 32.54,33.5 v32.54,32.54 | v31.27,30.16 30.09,30.16
  Top 0.254: v73.82,36.2 79.22,36.2 79.38,36.35 79.38,36.83 | PWR.A 8.46,45.76 6.35,43.66 6.35,24.77 6.83,24.29 16.35,24.29 17.3,25.24 19.05,25.24 19.68,25.88 20.95,25.88 | 20.95,25.88 21.43,25.88 | C15.1 32.78,9.86 U5.8 36.83,9.53 | 36.83,10.64 34.92,12.54 C35.1 31.91,13.42 v31.91,13.65 | 36.83,10.64 36.83,9.53 | 36.83,9.53 U4.4 | 24.03,22.38 U6.8 | 58.26,17.62 58.1,17.78 | 58.26,17.62 58.58,17.94 61.12,17.94 61.91,17.14 61.91,16.99 62.08,16.82 U1.6 64.78,16.82 65.72,15.88 C5.1 | 59.93,25 55.4,20.48 49.24,14.32 48.9,14.32 U1.75 46.55,14.32 46.04,13.81 C9.1 45.46,13.79 C11.1 | 61.12,24.45 60.48,24.45 59.93,25 | 61.12,24.45 61.91,24.45 62.1,24.64 | 57.63,46.2 55.3,46.2 C27.1 | R29.2 57.89,46.46 57.63,46.2 | 62.55,37.31 59.93,39.93 | 60.48,41.75 62.39,41.75 62.71,42.07 U2.22 65.5,42.07 65.83,42.07 | U1.22 U1.21 63.18,24.32 62.87,24.64 | v39.37,10.64 36.83,10.64
  Top 0.406: 49.21,26.67 55.4,20.48 58.02,17.86 58.1,17.78 | 65.41,25.08 64.96,24.64 62.87,24.64 62.1,24.64 | v44.29,11.11 45.88,11.11 48.9,14.29 48.9,14.32 | 62.55,37.31 63.02,36.83 63.02,27.62 61.75,26.35 60.24,26.35 | C3.1 C12.1 65.8,26.75 66.99,27.94 66.99,30.07 X2.4 X2.1
  Bottom 0.254: v67.63,9.84 v67.63,13.02 | v85.09,13.34 v85.09,9.68 | v32.54,32.54 32.54,31.43 v31.27,30.16 | v70.96,35.24 71.91,36.2 v73.82,36.2 | v30,18.41 30,15.56 v31.91,13.65
  Bottom 0.406: v39.37,10.64 39.85,11.11 v44.29,11.11
  pour Top: 61.91,26.99 61.91,13.65 48.58,13.65 48.58,26.99
  pour Top: 56.2,43.5 62.87,43.5 62.71,37.15 56.2,37.15

### Text on the board
Bottom: REV. B | 06/2015
tPlace: ETHERBOTIX. COPYRIGHT 2014-2015 M. FERGUSON | 1B | 1A | 2A | A | S | PA8 | PE4 | 2B | PB8 | PB9 | PE0 | PE1
tNames: D7 | D6 | D5 | D4 | D3 | A2 | A1 | A0 | J10 | U4 | PC12 | PD0 | PD1 | PD2 | G | +V | (+L) | AUX.